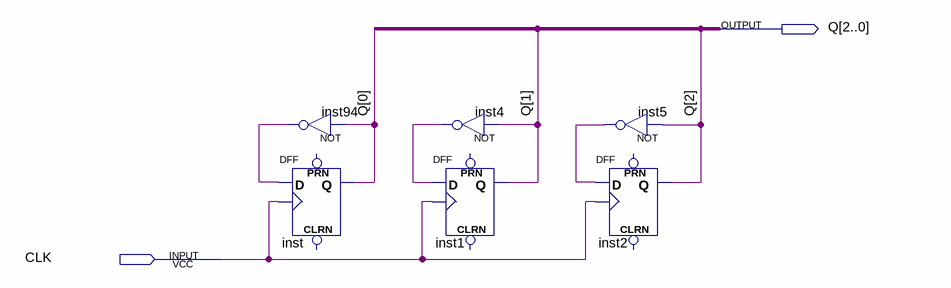
[diagram p0: schematic sheet]
// Quartus schematic Block3.bdf as structural Verilog: 6 symbols, 2 pins
module Block3 (
  input  CLK,
  output [2:0] Q
);

  wire inst4_out, inst5_out, inst94_out;

  not inst94 (inst94_out, Q[0]);
  DFF inst (.CLK(CLK), .D(inst94_out), .Q(Q[0]));  // open: CLRN, PRN
  not inst4 (inst4_out, Q[1]);
  DFF inst1 (.CLK(CLK), .D(inst4_out), .Q(Q[1]));  // open: CLRN, PRN
  not inst5 (inst5_out, Q[2]);
  DFF inst2 (.CLK(CLK), .D(inst5_out), .Q(Q[2]));  // open: CLRN, PRN
endmodule
